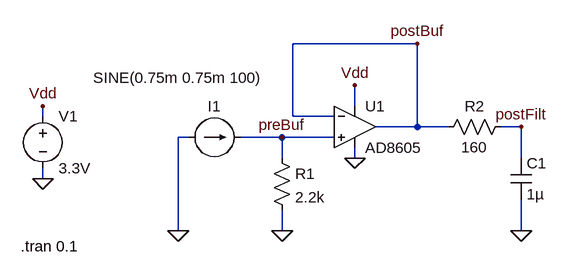
[diagram p0: schematic Buff_LowPass.asc]
Buff_LowPass.asc, the LTspice schematic file:
Version 4
SHEET 1 880 680
WIRE 304 112 112 112
WIRE 208 208 208 176
WIRE -272 224 -272 208
WIRE 112 224 112 112
WIRE 176 224 112 224
WIRE 304 240 304 112
WIRE 304 240 240 240
WIRE 352 240 304 240
WIRE 464 240 432 240
WIRE -48 256 -64 256
WIRE 96 256 32 256
WIRE 176 256 96 256
WIRE 96 288 96 256
WIRE 208 288 208 272
WIRE 464 288 464 240
WIRE -272 320 -272 304
WIRE -64 400 -64 256
WIRE 96 400 96 368
WIRE 464 400 464 352
FLAG 208 288 0
FLAG -272 320 0
FLAG -272 208 Vdd
FLAG 208 176 Vdd
FLAG -64 400 0
FLAG 96 400 0
FLAG 464 400 0
FLAG 96 256 preBuf
FLAG 304 112 postBuf
FLAG 464 240 postFilt
SYMBOL OpAmps\\AD8605 208 176 R0
SYMATTR InstName U1
SYMBOL voltage -272 208 R0
WINDOW 123 0 0 Left 0
WINDOW 39 0 0 Left 0
SYMATTR InstName V1
SYMATTR Value 3.3V
SYMBOL current -48 256 R270
WINDOW 0 32 40 VTop 2
WINDOW 3 107 -16 VBottom 2
WINDOW 123 0 0 Left 0
WINDOW 39 0 0 Left 0
SYMATTR InstName I1
SYMATTR Value SINE(0.75m 0.75m 100)
SYMBOL res 80 272 R0
SYMATTR InstName R1
SYMATTR Value 2.2k
SYMBOL cap 448 288 R0
SYMATTR InstName C1
SYMATTR Value 1µ
SYMBOL res 448 224 R90
WINDOW 0 0 56 VBottom 2
WINDOW 3 32 56 VTop 2
SYMATTR InstName R2
SYMATTR Value 160
TEXT -306 424 Left 2 !.tran 0.1

The netlist it stands for:
* Buff_LowPass.asc
XU1 preBuf postBuf Vdd 0 postBuf AD8605  ; pins In+ In- V+ V- OUT
V1 Vdd 0 3.3V
I1 0 preBuf SINE(0.75m 0.75m 100)
R1 preBuf 0 2.2k
C1 postFilt 0 1µ
R2 postFilt postBuf 160
.tran 0.1
.lib ADI.lib
.backanno
.end